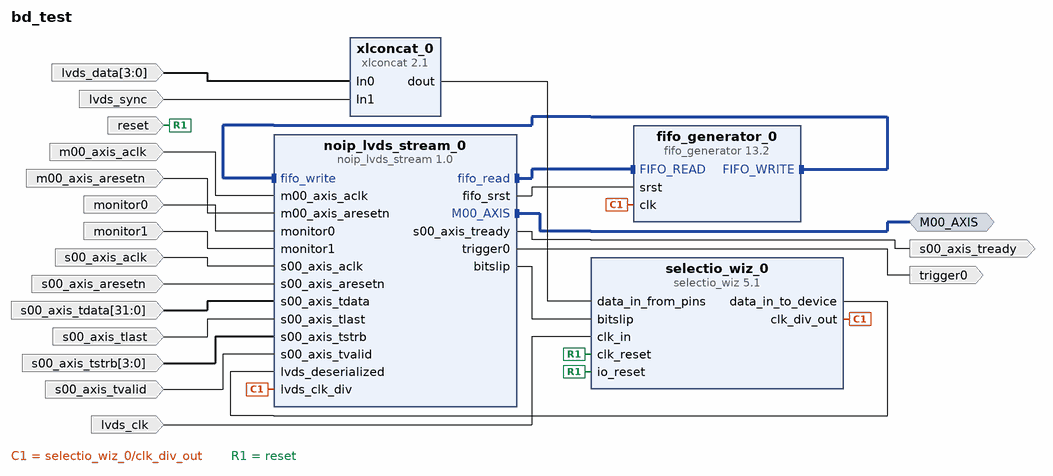
[diagram p0: block diagram of the top level]
# Vivado block design bd_test, xc7z020iclg400-1L, Vivado 2024.1
create_bd_design bd_test

create_bd_intf_port -mode Master -vlnv xilinx.com:interface:axis_rtl:1.0 M00_AXIS
create_bd_port -dir I monitor0
create_bd_port -dir I monitor1
create_bd_port -dir I -type rst m00_axis_aresetn
create_bd_port -dir I -type clk m00_axis_aclk
set_property -dict {CONFIG.ASSOCIATED_BUSIF M00_AXIS} [get_bd_ports m00_axis_aclk]
create_bd_port -dir I -type rst s00_axis_aresetn
create_bd_port -dir I -type clk s00_axis_aclk
create_bd_port -dir O trigger0
create_bd_port -dir I s00_axis_tvalid
create_bd_port -dir I s00_axis_tlast
create_bd_port -dir I -from 3 -to 0 s00_axis_tstrb
create_bd_port -dir I -from 31 -to 0 s00_axis_tdata
create_bd_port -dir O s00_axis_tready
create_bd_port -dir I -type rst reset
set_property -dict {CONFIG.POLARITY ACTIVE_HIGH} [get_bd_ports reset]
create_bd_port -dir I -type clk lvds_clk
create_bd_port -dir I -from 3 -to 0 lvds_data
create_bd_port -dir I -type data lvds_sync

create_bd_cell -type ip -vlnv xilinx.com:ip:selectio_wiz:5.1 selectio_wiz_0
set_property -dict [list \
  CONFIG.BUS_IO_STD LVCMOS33 \
  CONFIG.CLK_FWD_IO_STD LVCMOS33 \
  CONFIG.SELIO_CLK_IO_STD LVCMOS33 \
  CONFIG.SELIO_INTERFACE_TYPE NETWORKING \
  CONFIG.SERIALIZATION_FACTOR 8 \
  CONFIG.SYSTEM_DATA_WIDTH 5 \
  CONFIG.USE_SERIALIZATION true \
] [get_bd_cells selectio_wiz_0]
create_bd_cell -type ip -vlnv user.org:user:noip_lvds_stream:1.0 noip_lvds_stream_0
create_bd_cell -type ip -vlnv xilinx.com:ip:fifo_generator:13.2 fifo_generator_0
create_bd_cell -type ip -vlnv xilinx.com:ip:xlconcat:2.1 xlconcat_0
set_property -dict {CONFIG.IN0_WIDTH 4} [get_bd_cells xlconcat_0]

# ---- connections ----

connect_bd_intf_net [get_bd_intf_ports M00_AXIS] [get_bd_intf_pins noip_lvds_stream_0/M00_AXIS]
connect_bd_intf_net [get_bd_intf_pins noip_lvds_stream_0/fifo_read] [get_bd_intf_pins fifo_generator_0/FIFO_READ]
connect_bd_intf_net [get_bd_intf_pins fifo_generator_0/FIFO_WRITE] [get_bd_intf_pins noip_lvds_stream_0/fifo_write]
connect_bd_net -net In0_0_1 [get_bd_ports lvds_data] [get_bd_pins xlconcat_0/In0]
connect_bd_net [get_bd_pins selectio_wiz_0/clk_div_out] [get_bd_pins fifo_generator_0/clk] [get_bd_pins noip_lvds_stream_0/lvds_clk_div]
connect_bd_net -net clk_in_0_1 [get_bd_ports lvds_clk] [get_bd_pins selectio_wiz_0/clk_in]
connect_bd_net -net clk_reset_0_1 [get_bd_ports reset] [get_bd_pins selectio_wiz_0/clk_reset] [get_bd_pins selectio_wiz_0/io_reset]
connect_bd_net [get_bd_ports lvds_sync] [get_bd_pins xlconcat_0/In1]
connect_bd_net -net m00_axis_aclk_0_1 [get_bd_ports m00_axis_aclk] [get_bd_pins noip_lvds_stream_0/m00_axis_aclk]
connect_bd_net -net m00_axis_aresetn_0_1 [get_bd_ports m00_axis_aresetn] [get_bd_pins noip_lvds_stream_0/m00_axis_aresetn]
connect_bd_net -net monitor0_0_1 [get_bd_ports monitor0] [get_bd_pins noip_lvds_stream_0/monitor0]
connect_bd_net -net monitor1_0_1 [get_bd_ports monitor1] [get_bd_pins noip_lvds_stream_0/monitor1]
connect_bd_net [get_bd_pins noip_lvds_stream_0/bitslip] [get_bd_pins selectio_wiz_0/bitslip]
connect_bd_net [get_bd_pins noip_lvds_stream_0/fifo_srst] [get_bd_pins fifo_generator_0/srst]
connect_bd_net [get_bd_pins noip_lvds_stream_0/s00_axis_tready] [get_bd_ports s00_axis_tready]
connect_bd_net [get_bd_pins noip_lvds_stream_0/trigger0] [get_bd_ports trigger0]
connect_bd_net -net s00_axis_aclk_0_1 [get_bd_ports s00_axis_aclk] [get_bd_pins noip_lvds_stream_0/s00_axis_aclk]
connect_bd_net -net s00_axis_aresetn_0_1 [get_bd_ports s00_axis_aresetn] [get_bd_pins noip_lvds_stream_0/s00_axis_aresetn]
connect_bd_net -net s00_axis_tdata_0_1 [get_bd_ports s00_axis_tdata] [get_bd_pins noip_lvds_stream_0/s00_axis_tdata]
connect_bd_net -net s00_axis_tlast_0_1 [get_bd_ports s00_axis_tlast] [get_bd_pins noip_lvds_stream_0/s00_axis_tlast]
connect_bd_net -net s00_axis_tstrb_0_1 [get_bd_ports s00_axis_tstrb] [get_bd_pins noip_lvds_stream_0/s00_axis_tstrb]
connect_bd_net -net s00_axis_tvalid_0_1 [get_bd_ports s00_axis_tvalid] [get_bd_pins noip_lvds_stream_0/s00_axis_tvalid]
connect_bd_net [get_bd_pins selectio_wiz_0/data_in_to_device] [get_bd_pins noip_lvds_stream_0/lvds_deserialized]
connect_bd_net [get_bd_pins xlconcat_0/dout] [get_bd_pins selectio_wiz_0/data_in_from_pins]

validate_bd_design
save_bd_design
